# Altium schematic sheet P1.SchDoc: DIO MCX 16 Isolated
size A4; DocumentNumber: 6; SheetNumber: 6; SheetTotal: 7; ModifiedBy: -; CreateDate: XX/XX/XXXX; CheckedDate: -; Title2: Title2; DivGrp: CTI
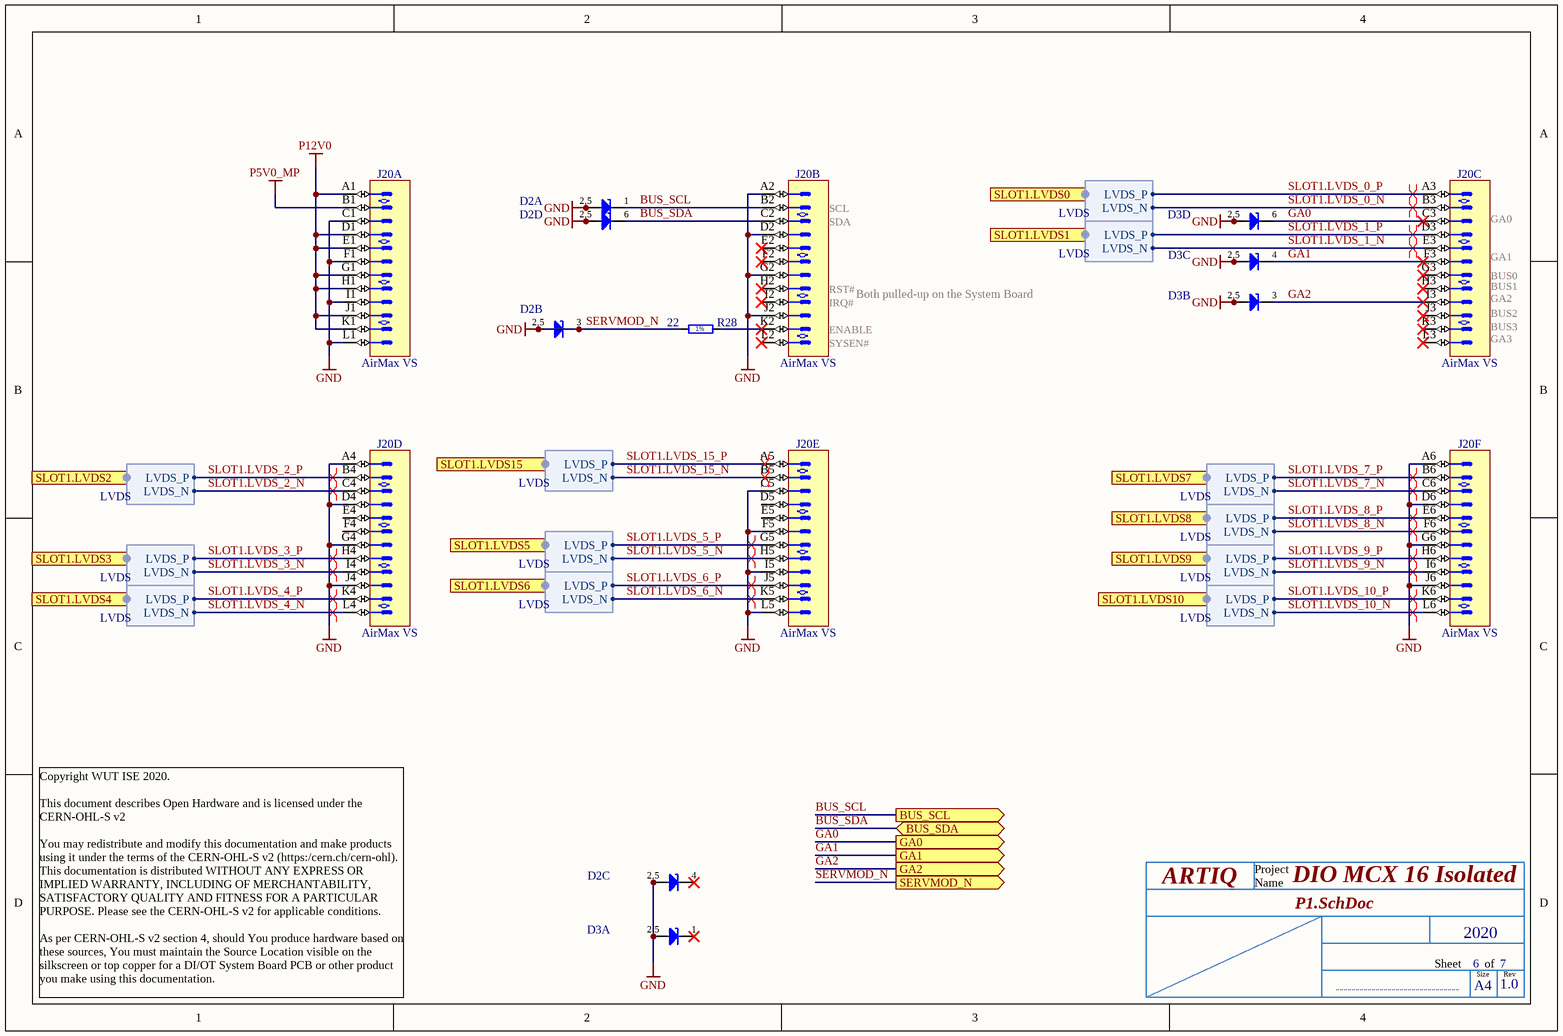
[diagram p0: P1.SchDoc]

## Parts
D2  PESD3V3S4UD  [SOT95P280X110-6N]  (value not drawn)  (parts A,B,C,D of 4)
D3  PESD3V3S4UD  [SOT95P280X110-6N]  (value not drawn)  (parts A,B,C,D of 4)
J20  AirMax VS  [AMPHENOL_10052825-101LF]  (parts A,B,C,D,E,F of 6)
R28  22  [RESC1005X40N]

## Ports
BUS_SCL (out), BUS_SDA (bidir), GA0 (out), GA1 (out), GA2 (out), SERVMOD_N (out), SLOT1.LVDS0 (harness LVDS), SLOT1.LVDS1 (harness LVDS), SLOT1.LVDS2 (harness LVDS), SLOT1.LVDS3 (harness LVDS), SLOT1.LVDS4 (harness LVDS), SLOT1.LVDS5 (harness LVDS), SLOT1.LVDS6 (harness LVDS), SLOT1.LVDS7 (harness LVDS), SLOT1.LVDS8 (harness LVDS), SLOT1.LVDS9 (harness LVDS), SLOT1.LVDS10 (harness LVDS), SLOT1.LVDS15 (harness LVDS)

## Harnesses
LVDS: LVDS_P, LVDS_N

## Nets
GND: D2.2(A) D2.5(A) D3.2(A) D3.5(A) J20.A2 J20.A4 J20.A6 J20.C1 J20.C5 J20.D2 J20.D4 J20.D6 J20.F1 J20.F5 J20.G2 J20.G4 J20.G6 J20.I1 J20.I5 J20.J2 J20.J4 J20.J6 J20.L1 J20.L5
P5V0_MP: J20.B1
P12V0: J20.A1 J20.D1 J20.E1 J20.G1 J20.H1 J20.J1 J20.K1
BUS_SCL: D2.1(C) J20.B2 ; port BUS_SCL
BUS_SDA: D2.6(C) J20.C2 ; port BUS_SDA
GA0: D3.6(C) J20.C3 ; port GA0
GA1: D3.4(C) J20.F3 ; port GA1
GA2: D3.3(C) J20.I3 ; port GA2
SERVMOD_N: D2.3(C) R28.1 ; port SERVMOD_N
SLOT1.LVDS_0_N: J20.B3 ; port SLOT1.LVDS0.LVDS_N
SLOT1.LVDS_0_P: J20.A3 ; port SLOT1.LVDS0.LVDS_P
SLOT1.LVDS_1_N: J20.E3 ; port SLOT1.LVDS1.LVDS_N
SLOT1.LVDS_1_P: J20.D3 ; port SLOT1.LVDS1.LVDS_P
SLOT1.LVDS_2_N: J20.C4 ; port SLOT1.LVDS2.LVDS_N
SLOT1.LVDS_2_P: J20.B4 ; port SLOT1.LVDS2.LVDS_P
SLOT1.LVDS_3_N: J20.I4 ; port SLOT1.LVDS3.LVDS_N
SLOT1.LVDS_3_P: J20.H4 ; port SLOT1.LVDS3.LVDS_P
SLOT1.LVDS_4_N: J20.L4 ; port SLOT1.LVDS4.LVDS_N
SLOT1.LVDS_4_P: J20.K4 ; port SLOT1.LVDS4.LVDS_P
SLOT1.LVDS_5_N: J20.H5 ; port SLOT1.LVDS5.LVDS_N
SLOT1.LVDS_5_P: J20.G5 ; port SLOT1.LVDS5.LVDS_P
SLOT1.LVDS_6_N: J20.K5 ; port SLOT1.LVDS6.LVDS_N
SLOT1.LVDS_6_P: J20.J5 ; port SLOT1.LVDS6.LVDS_P
SLOT1.LVDS_7_N: J20.C6 ; port SLOT1.LVDS7.LVDS_N
SLOT1.LVDS_7_P: J20.B6 ; port SLOT1.LVDS7.LVDS_P
SLOT1.LVDS_8_N: J20.F6 ; port SLOT1.LVDS8.LVDS_N
SLOT1.LVDS_8_P: J20.E6 ; port SLOT1.LVDS8.LVDS_P
SLOT1.LVDS_9_N: J20.I6 ; port SLOT1.LVDS9.LVDS_N
SLOT1.LVDS_9_P: J20.H6 ; port SLOT1.LVDS9.LVDS_P
SLOT1.LVDS_10_N: J20.L6 ; port SLOT1.LVDS10.LVDS_N
SLOT1.LVDS_10_P: J20.K6 ; port SLOT1.LVDS10.LVDS_P
SLOT1.LVDS_15_N: J20.B5 ; port SLOT1.LVDS15.LVDS_N
SLOT1.LVDS_15_P: J20.A5 ; port SLOT1.LVDS15.LVDS_P
NetJ20_K2: J20.K2 R28.2

Not connected (* = marked no-connect by the designer): D2 4(C)*; D3 1(C)*; J20 D5 E2* E4 E5 F2* F4 G3* H2* H3* I2* J3* K3* L2* L3*

## Layout directives
differential pair: SLOT1.LVDS_0_N, SLOT1.LVDS_0_P, SLOT1.LVDS_1_N, SLOT1.LVDS_1_P, SLOT1.LVDS_2_N, SLOT1.LVDS_2_P, SLOT1.LVDS_3_N, SLOT1.LVDS_3_P, SLOT1.LVDS_4_N, SLOT1.LVDS_4_P, SLOT1.LVDS_5_N, SLOT1.LVDS_5_P, SLOT1.LVDS_6_N, SLOT1.LVDS_6_P, SLOT1.LVDS_7_N, SLOT1.LVDS_7_P, SLOT1.LVDS_8_N, SLOT1.LVDS_8_P, SLOT1.LVDS_9_N, SLOT1.LVDS_9_P, SLOT1.LVDS_10_N, SLOT1.LVDS_10_P, SLOT1.LVDS_15_N, SLOT1.LVDS_15_P

## Notes on the sheet
- (near J20) SCL
- (near J20) SDA
- (near J20) GA0
- (near J20) RST#
- (near J20) IRQ#
- Both pulled-up on the System Board
- (near J20) BUS0
- (near J20) BUS1
- (near J20) BUS2
- (near J20) GA1
- (near J20) GA2
- (near J20) ENABLE
- (near J20) SYSEN#
- (near J20) BUS3
- (near J20) GA3
- ARTIQ
- Project
- Name
- Sheet
- 2020
- Size
- A4
- of
- 1.0
- Rev
- Copyright WUT ISE 2020.
  This document describes Open Hardware and is licensed under the CERN-OHL-S v2
  You may redistribute and modify this documentation and make products using it under the terms of the CERN-OHL-S v2 (https:/cern.ch/cern-ohl). This documentation is distributed WITHOUT ANY EXPRESS OR IMPLIED WARRANTY, INCLUDING OF MERCHANTABILITY, SATISFACTORY QUALITY AND FITNESS FOR A PARTICULAR PURPOSE. Please see the CERN-OHL-S v2 for applicable conditions.
  As per CERN-OHL-S v2 section 4, should You produce hardware based on these sources, You must maintain the Source Location visible on the silkscreen or top copper for a DI/OT System Board PCB or other product you make using this documentation.
- -------------------------------
- (in symbol PESD3V3S4UD, part A) 2,5
- (in symbol PESD3V3S4UD, part B) 2,5
- (in symbol PESD3V3S4UD, part C) 2,5
- (in symbol PESD3V3S4UD, part D) 2,5
- (in symbol R0402_22R_1%_0.0625W_100PPM) 1%

## Library data of the parts
D2 D3 = PESD3V3S4UD: Quad Common Anode ESD Protection Diodes (30kV); Manufacturer: NXP SEMICONDUCTORS; Voltage: 3V3; Power: 200W; PressFit: No; Bonding: No; Part Number: PESD3V3S4UD; Component Kind: Standard; Component Type: Standard; Device: PESD3V3S4UD; PackageDescription: SOT, 0.95mm Pitch; 6 Pin, 1.60mm W X 2.90mm L X 1.10mm H Body, IPC Medium Density; Part Description: Quad Common Anode ESD Protection Diodes (30kV); Manufacturer Part Number: PESD3V3S4UD; Pin Count: 6; Case: SOT23-6; Mounted: Yes; Socket: No; SMD: Yes; Sense: No; ComponentHeight: 1.1mm; HelpURL: \\cern.ch\dfs\Applications\Altium\Datasheets\PESD3V3S4UD.pdf; Author: CERN DEM MR; CreateDate: 08/02/2016; LatestRevisionDate: 16/01/2018
J20 = AMPHENOL_10052825-101LF: 72 Contacts Header, 6 Columns, 4 Pairs per Column; Part Description: 72 Contacts, 2mm Pitch, 6 Columns, 4 Pairs per Column, 4 Walls, Right Angle Header; Part Number: AMPHENOL_10052825-101LF; Component Kind: Standard; Component Type: Standard; Pin Count: 72; Family: AirMax VS; Mounted: Yes; Socket: No; SMD: No; PressFit: Yes; Sense: No; Status: None; Manufacturer: AMPHENOL; Manufacturer Part Number: 10052825-101LF; ComponentHeight: 15.35mm; HelpURL: \\cern.ch\dfs\Applications\Altium\Datasheets\AMPHENOL_10052825-101LF.pdf; ComponentLink1URL: \\cern.ch\dfs\Applications\Altium\Datasheets\AMPHENOL_10052825-101LF_Application.pdf; ComponentLink1Description: Application; Author: CERN DEM MR; CreateDate: 19/02/2018; LatestRevisionDate: 19/02/2018
R28 = R0402_22R_1%_0.0625W_100PPM: Resistor - 1%; Part Description: General Purpose Thick Film Chip Resistor; Manufacturer: GENERIC; Manufacturer1 Part Number: 232270672209L; TC: ±100ppm/°C; PressFit: No; Part Number: R0402_22R_1%_0.0625W_100PPM; Component Kind: Standard; Component Type: Standard; Pin Count: 2; Value: 22; Status: Not Recommended; Power: 0.0625W; Tolerance: ±1%; Manufacturer Part Number: R0402_22R_1%_0.0625W_100PPM; Case: 0402; Mounted: Yes; Socket: No; SMD: Yes; Manufacturer1 Example: YAGEO PHYCOMP; Manufacturer1 ComponentHeight: 0.4mm; HelpURL: \\cern.ch\dfs\Applications\Altium\Datasheets\R0402_Phycomp_RC0402.pdf; Author: CERN DEM JLC; CreateDate: 03.12.2007; LatestRevisionDate: 17.10.2012; Sense: No